# EAGLE design PhotonOnAStick-V3 (EAGLE 7.4.0)
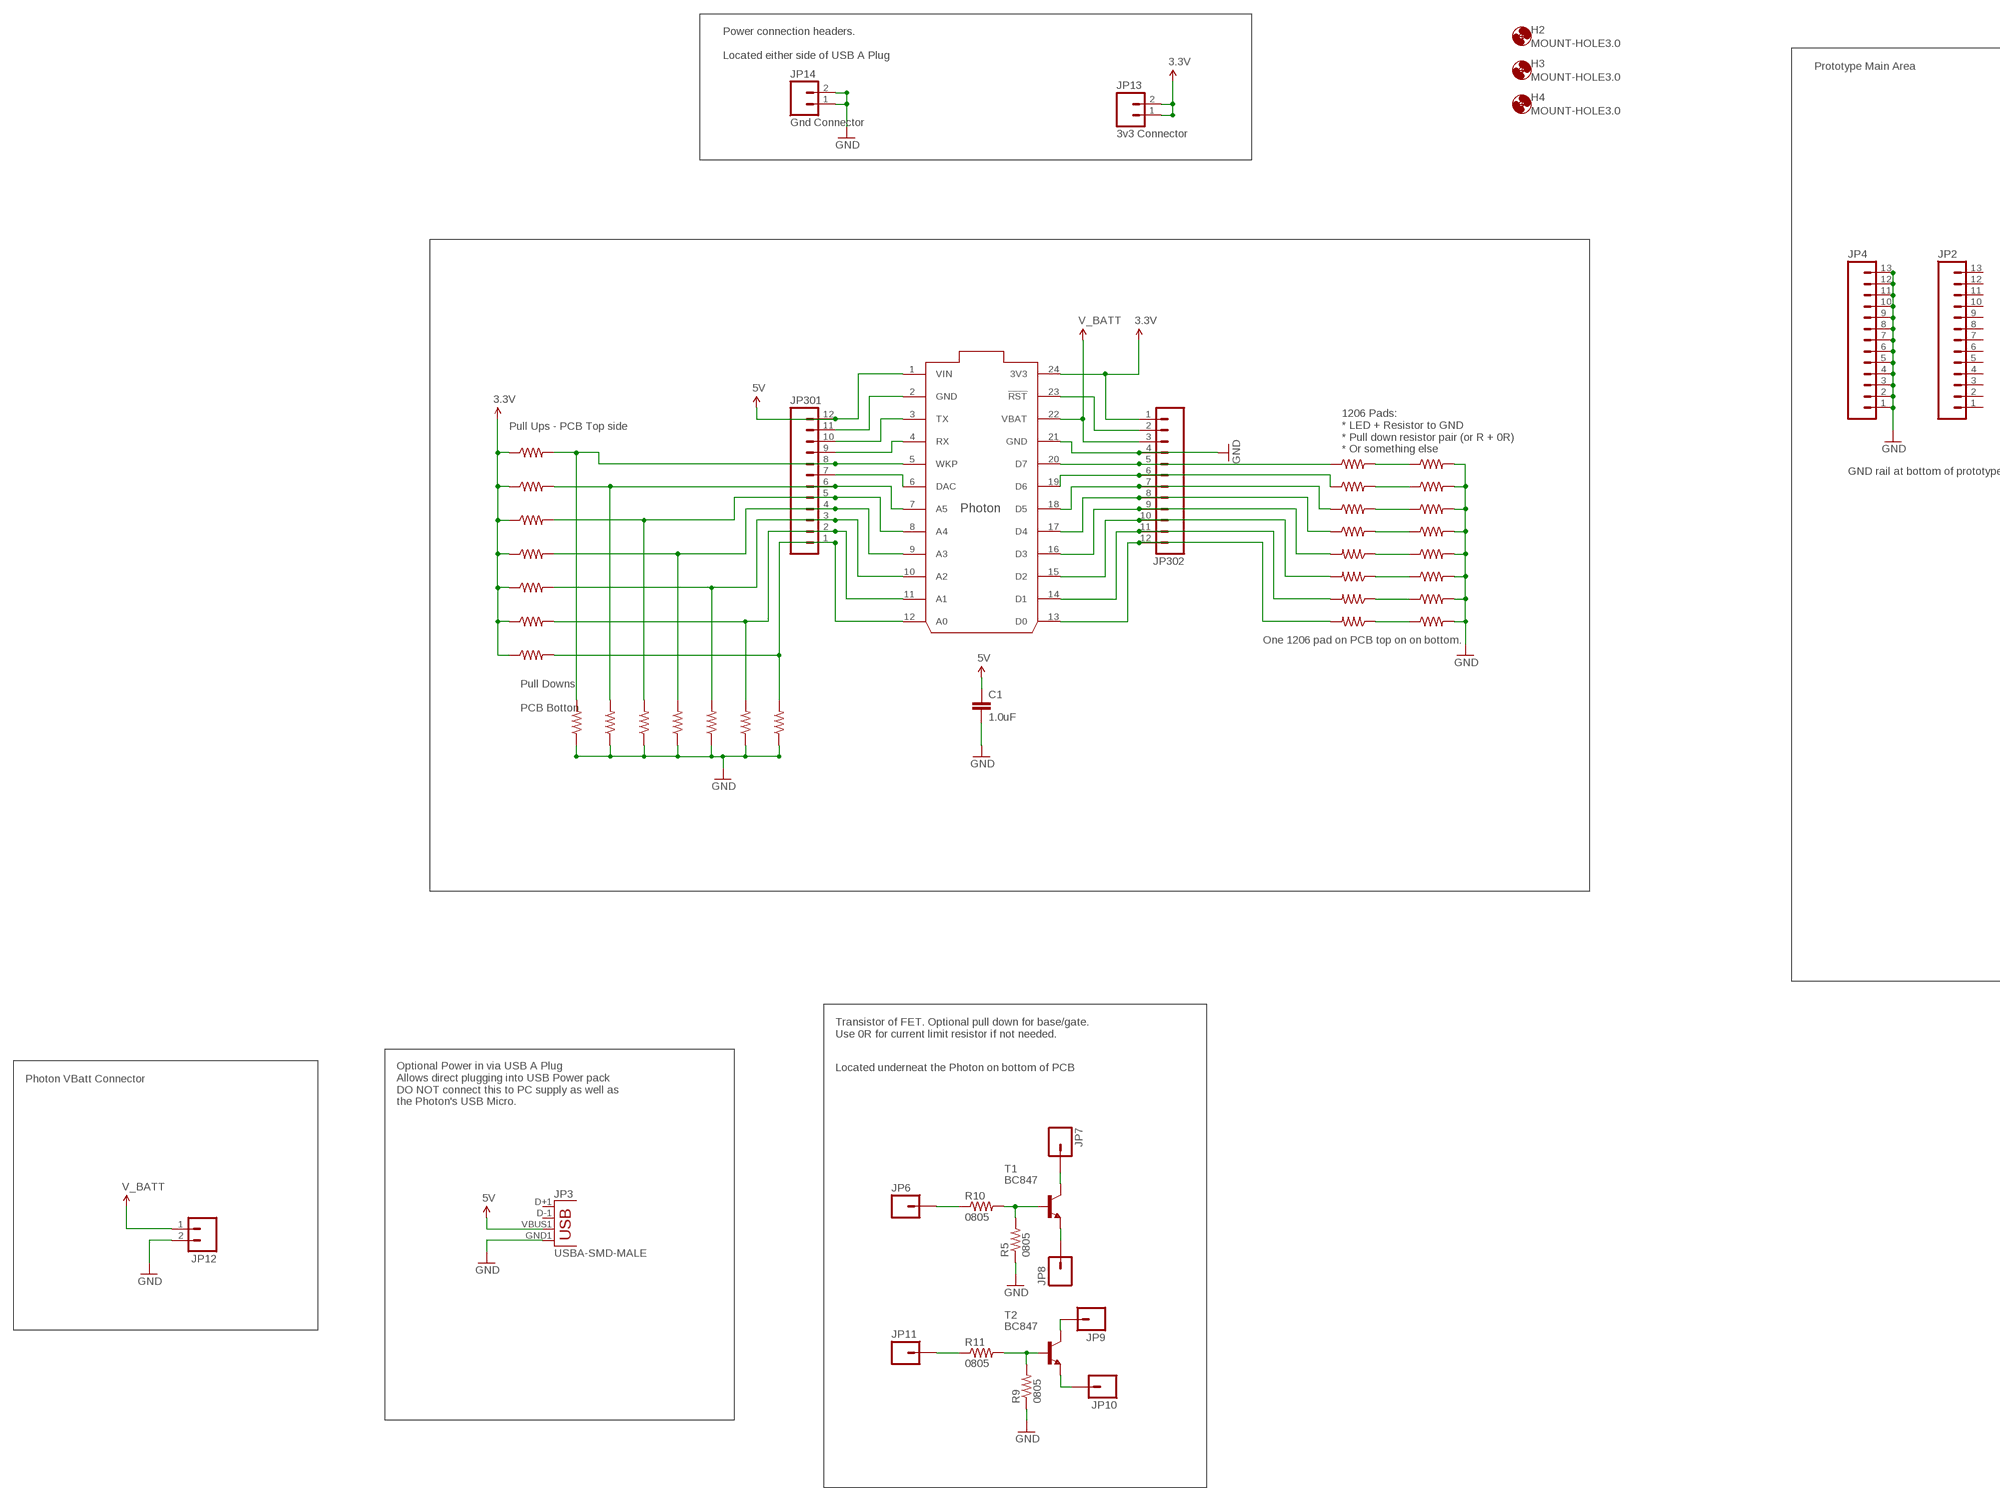
[diagram p0: schematic, sheet 1, part 1 of 2]
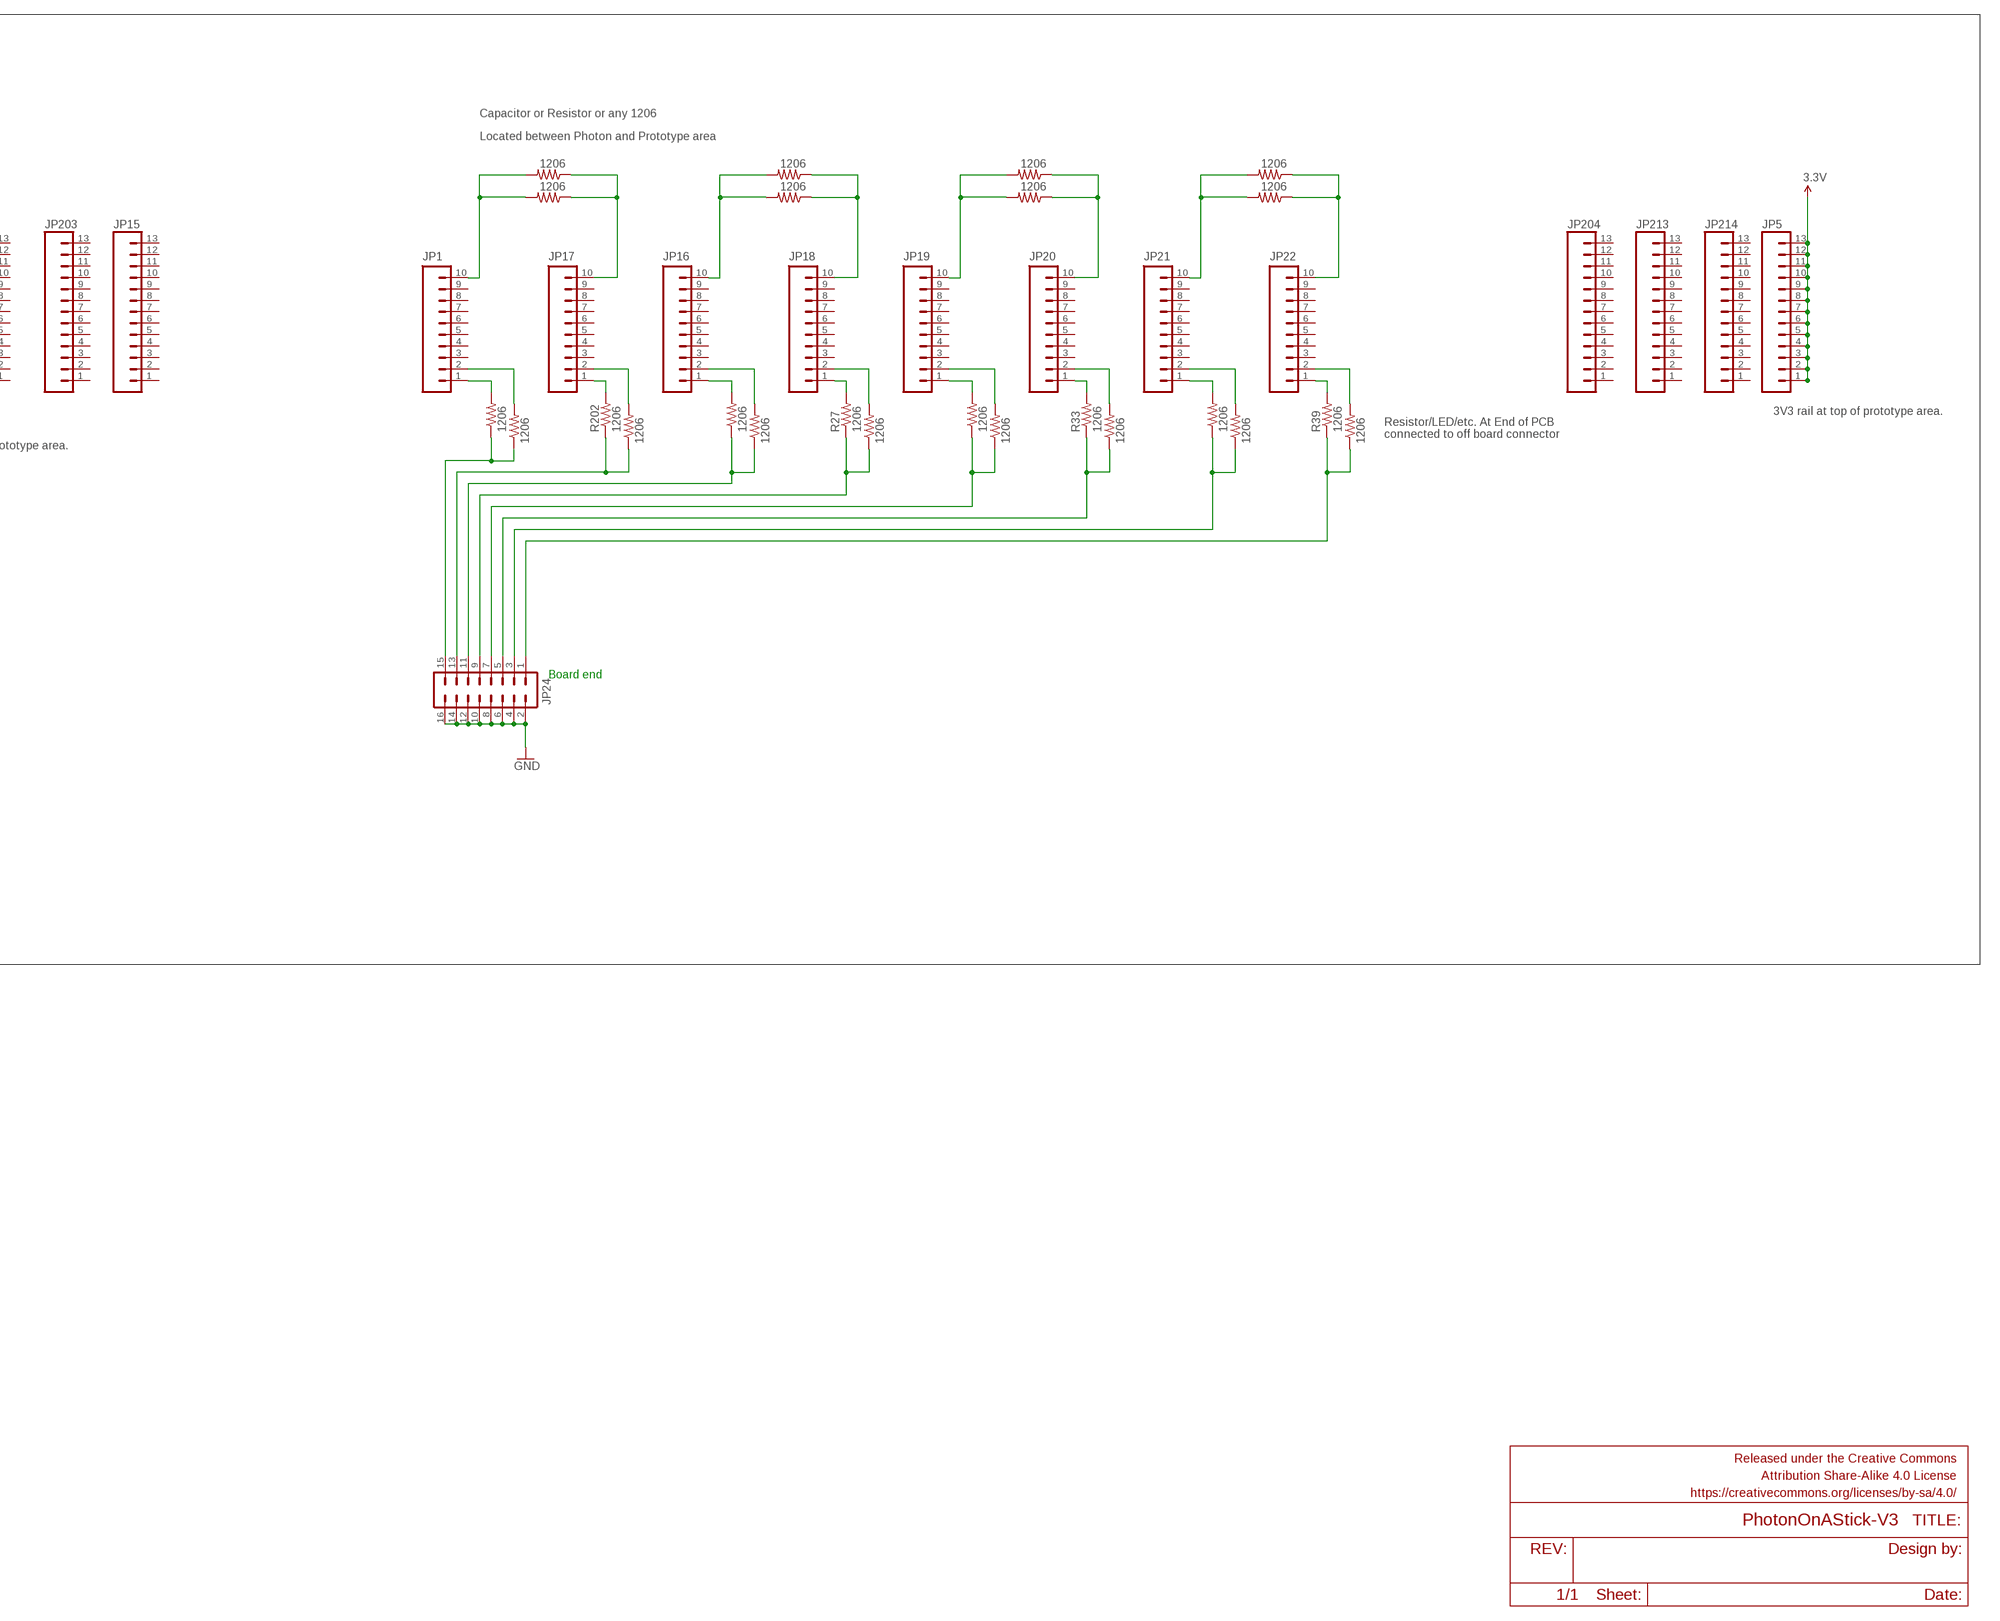
[diagram p1: schematic, sheet 1, part 2 of 2]

## Parts
C1  1.0uF  1.0UF-25V-+80/-20(0805)"  [0805-CAP]
FRAME1  FRAME-LEDGER  [CREATIVE_COMMONS]
H2  MOUNT-HOLE3.0  [3,0]
H3  MOUNT-HOLE3.0  [3,0]
H4  MOUNT-HOLE3.0  [3,0]
IC1  PHOTON_WITH_HEADERS  [PHOTON]
JP1  M10SILK_FEMALE_PTH  [1X10]
JP2  M13  [1X13]
JP3  USBA-SMD-MALE  [USB-A-SMT-MALE]
JP4  M13  [1X13]
JP5  M13  [1X13]
JP6  M01PTH  [1X01]
JP7  M01PTH  [1X01]
JP8  M01PTH  [1X01]
JP9  M01PTH  [1X01]
JP10  M01PTH  [1X01]
JP11  M01PTH  [1X01]
JP12  M02JST-PTH-2  [JST-2-PTH]
JP13  3v3 Connector  M02PTH  [1X02]
JP14  Gnd Connector  M02PTH  [1X02]
JP15  M13  [1X13]
JP16  M10SILK_FEMALE_PTH  [1X10]
JP17  M10SILK_FEMALE_PTH  [1X10]
JP18  M10SILK_FEMALE_PTH  [1X10]
JP19  M10SILK_FEMALE_PTH  [1X10]
JP20  M10SILK_FEMALE_PTH  [1X10]
JP21  M10SILK_FEMALE_PTH  [1X10]
JP22  M10SILK_FEMALE_PTH  [1X10]
JP24  M08X2  [2X8]
JP203  M13  [1X13]
JP204  M13  [1X13]
JP213  M13  [1X13]
JP214  M13  [1X13]
JP301  M12PTH  [1X12]
JP302  M12PTH  [1X12]
R1  1206  RESISTOR1206  [1206]
R2  1206  RESISTOR1206  [1206]
R3  1206  RESISTOR1206  [1206]
R4  1206  RESISTOR1206  [1206]
R5  0805  RESISTOR0805-RES  [0805]
R6  1206  RESISTOR1206  [1206]
R7  1206  RESISTOR1206  [1206]
R8  1206  RESISTOR1206  [1206]
R9  0805  RESISTOR0805-RES  [0805]
R10  0805  RESISTOR0805-RES  [0805]
R11  0805  RESISTOR0805-RES  [0805]
R12  1206  RESISTOR1206  [1206]
R13  1206  RESISTOR1206  [1206]
R14  1206  RESISTOR1206  [1206]
R15  1206  RESISTOR1206  [1206]
R16  1206  RESISTOR1206  [1206]
R17  1206  RESISTOR1206  [1206]
R18  1206  RESISTOR1206  [1206]
R19  1206  RESISTOR1206  [1206]
R20  1206  RESISTOR1206  [1206]
R21  1206  RESISTOR1206  [1206]
R22  1206  RESISTOR1206  [1206]
R23  1206  RESISTOR1206  [1206]
R24  1206  RESISTOR1206  [1206]
R25  1206  RESISTOR1206  [1206]
R26  1206  RESISTOR1206  [1206]
R27  1206  RESISTOR1206  [1206]
R28  1206  RESISTOR1206  [1206]
R29  1206  RESISTOR1206  [1206]
R30  1206  RESISTOR1206  [1206]
R31  1206  RESISTOR1206  [1206]
R32  1206  RESISTOR1206  [1206]
R33  1206  RESISTOR1206  [1206]
R34  1206  RESISTOR1206  [1206]
R35  1206  RESISTOR1206  [1206]
R36  1206  RESISTOR1206  [1206]
R37  1206  RESISTOR1206  [1206]
R38  1206  RESISTOR1206  [1206]
R39  1206  RESISTOR1206  [1206]
R40  1206  RESISTOR1206  [1206]
R41  1206  RESISTOR1206  [1206]
R42  1206  RESISTOR1206  [1206]
R43  1206  RESISTOR1206  [1206]
R44  1206  RESISTOR1206  [1206]
R201  1206  RESISTOR1206  [1206]
R202  1206  RESISTOR1206  [1206]
R313  1206  RESISTOR1206  [1206]
R314  1206  RESISTOR1206  [1206]
R315  1206  RESISTOR1206  [1206]
R316  1206  RESISTOR1206  [1206]
R317  1206  RESISTOR1206  [1206]
R318  1206  RESISTOR1206  [1206]
R319  1206  RESISTOR1206  [1206]
R320  1206  RESISTOR1206  [1206]
R410  1206  RESISTOR1206  [1206]
R411  1206  RESISTOR1206  [1206]
R412  1206  RESISTOR1206  [1206]
R413  1206  RESISTOR1206  [1206]
T1  BC847  [SOT23]
T2  BC847  [SOT23]

## Nets
3.3V: IC1.24(3V3) JP5.1 JP5.2 JP5.3 JP5.4 JP5.5 JP5.6 JP5.7 JP5.8 JP5.9 JP5.10 JP5.11 JP5.12 JP5.13 JP13.1 JP13.2 JP302.1 R1.1 R2.1 R3.1 R4.1 R6.1 R7.1 R12.1
5V: C1.1 IC1.1(VIN) JP3.VBUS1(VBUS) JP301.12
GND: C1.2 IC1.2(GND) IC1.21(GND) JP3.GND1(GND) JP4.1 JP4.2 JP4.3 JP4.4 JP4.5 JP4.6 JP4.7 JP4.8 JP4.9 JP4.10 JP4.11 JP4.12 JP4.13 JP12.2 JP14.1 JP14.2 JP24.2 JP24.4 JP24.6 JP24.8 JP24.10 JP24.12 JP24.14 JP24.16 JP301.11 JP302.4 R5.1 R8.1 R9.1 R13.1 R14.1 R15.2 R16.2 R17.2 R18.2 R19.1 R20.1 R21.1 R22.1 R410.2 R411.2 R412.2 R413.2
N$1: JP6.1 R10.1
N$2: JP17.1 R202.2
N$3: JP1.1 R201.2
N$4: IC1.3(TX) JP301.10
N$5: IC1.4(RX) JP301.9
N$6: IC1.5(WKP) JP301.8 R8.2 R12.2
N$7: IC1.6(DAC) JP301.7
N$8: IC1.7(A5) JP301.6 R1.2 R13.2
N$9: IC1.8(A4) JP301.5 R2.2 R14.2
N$10: IC1.9(A3) JP301.4 R3.2 R19.2
N$11: IC1.10(A2) JP301.3 R4.2 R20.2
N$12: IC1.11(A1) JP301.2 R6.2 R21.2
N$13: IC1.12(A0) JP301.1 R7.2 R22.2
N$14: JP24.15 R23.1 R201.1
N$15: R5.2 R10.2 T1.1(B)
N$16: IC1.18(D5) JP302.7 R318.1
N$17: IC1.17(D4) JP302.8 R317.1
N$18: IC1.16(D3) JP302.9 R316.2
N$19: IC1.15(D2) JP302.10 R315.2
N$20: IC1.14(D1) JP302.11 R314.2
N$21: IC1.13(D0) JP302.12 R313.2
N$22: JP1.2 R23.2
N$23: JP1.10 R24.2 R25.2
N$24: IC1.23(!RST) JP302.2
N$25: R320.2 R410.1
N$26: JP17.10 R24.1 R25.1
N$27: JP17.2 R26.2
N$28: JP24.13 R26.1 R202.1
N$29: JP18.1 R27.2
N$30: JP16.1 R28.2
N$31: JP24.11 R28.1 R29.1
N$32: JP16.2 R29.2
N$33: JP16.10 R30.2 R31.2
N$34: JP18.10 R30.1 R31.1
N$35: JP18.2 R32.2
N$36: JP24.9 R27.1 R32.1
N$37: JP20.1 R33.2
N$38: IC1.20(D7) JP302.5 R320.1
N$39: IC1.19(D6) JP302.6 R319.1
N$40: JP19.1 R34.2
N$41: JP7.1 T1.3(C)
N$43: JP24.7 R34.1 R35.1
N$44: R18.1 R313.1
N$45: R17.1 R314.1
N$46: R16.1 R315.1
N$47: R15.1 R316.1
N$48: R317.2 R413.1
N$49: R318.2 R412.1
N$50: R319.2 R411.1
N$52: JP19.2 R35.2
N$53: JP19.10 R36.2 R37.2
N$54: JP20.10 R36.1 R37.1
N$55: JP8.1 T1.2(E)
N$56: JP20.2 R38.2
N$57: JP24.5 R33.1 R38.1
N$58: JP22.1 R39.2
N$59: JP11.1 R11.1
N$60: R9.2 R11.2 T2.1(B)
N$61: JP9.1 T2.3(C)
N$62: JP10.1 T2.2(E)
N$63: JP21.1 R40.2
N$64: JP24.3 R40.1 R41.1
N$65: JP21.2 R41.2
N$68: JP21.10 R42.2 R43.2
N$69: JP22.10 R42.1 R43.1
N$70: JP22.2 R44.2
N$72: JP24.1 R39.1 R44.1
V_BATT: IC1.22(VBAT) JP12.1 JP302.3
Unconnected: JP1.3 JP1.4 JP1.5 JP1.6 JP1.7 JP1.8 JP1.9 JP2.1 JP2.2 JP2.3 JP2.4 JP2.5 JP2.6 JP2.7 JP2.8 JP2.9 JP2.10 JP2.11 JP2.12 JP2.13 JP3.D+1(D+) JP3.D-1(D-) JP15.1 JP15.2 JP15.3 JP15.4 JP15.5 JP15.6 JP15.7 JP15.8 JP15.9 JP15.10 JP15.11 JP15.12 JP15.13 JP16.3 JP16.4 JP16.5 JP16.6 JP16.7 JP16.8 JP16.9 JP17.3 JP17.4 JP17.5 JP17.6 JP17.7 JP17.8 JP17.9 JP18.3 JP18.4 JP18.5 JP18.6 JP18.7 JP18.8 JP18.9 JP19.3 JP19.4 JP19.5 JP19.6 JP19.7 JP19.8 JP19.9 JP20.3 JP20.4 JP20.5 JP20.6 JP20.7 JP20.8 JP20.9 JP21.3 JP21.4 JP21.5 JP21.6 JP21.7 JP21.8 JP21.9 JP22.3 JP22.4 JP22.5 JP22.6 JP22.7 JP22.8 JP22.9 JP203.1 JP203.2 JP203.3 JP203.4 JP203.5 JP203.6 JP203.7 JP203.8 JP203.9 JP203.10 JP203.11 JP203.12 JP203.13 JP204.1 JP204.2 JP204.3 JP204.4 JP204.5 JP204.6 JP204.7 JP204.8 JP204.9 JP204.10 JP204.11 JP204.12 JP204.13 JP213.1 JP213.2 JP213.3 JP213.4 JP213.5 JP213.6 JP213.7 JP213.8 JP213.9 JP213.10 JP213.11 JP213.12 JP213.13 JP214.1 JP214.2 JP214.3 JP214.4 JP214.5 JP214.6 JP214.7 JP214.8 JP214.9 JP214.10 JP214.11 JP214.12 JP214.13

## Notes on the sheet
- Power connection headers.
  
  Located either side of USB A Plug
- Prototype Main Area
- Capacitor or Resistor or any 1206
- Located between Photon and Prototype area
- Pull Ups - PCB Top side
- 3V3 rail at top of prototype area.
- 1206 Pads:
  * LED + Resistor to GND
  * Pull down resistor pair (or R + 0R)
  * Or something else
- Resistor/LED/etc. At End of PCB 
  connected to off board connector
- GND rail at bottom of prototype area.
- One 1206 pad on PCB top on on bottom.
- Board end
- Pull Downs
  
  PCB Botton
- Transistor of FET. Optional pull down for base/gate.
  Use 0R for current limit resistor if not needed.
- Located underneat the Photon on bottom of PCB
- Photon VBatt Connector
- Optional Power in via USB A Plug
  Allows direct plugging into USB Power pack
  DO NOT connect this to PC supply as well as
  the Photon's USB Micro.

## Library data of the parts
C1 = SparkFun-Capacitors:1.0UF-25V-+80/-20(0805): CAP-11625; PROD_ID: CAP-11625
FRAME1 = SparkFun-Aesthetics:FRAME-LEDGER: Schematic Frame Standard 11x14 US Ledger frame
H2-H4 = holes:MOUNT-HOLE: MOUNTING HOLE with drill center marker
IC1 = Spark:PHOTON
JP1 JP16-JP22 = SparkFun-Connectors:M10: Header 10 Standard 10-pin 0.1" header. Use with straight break away headers (SKU : PRT-00116), right angle break away headers (PRT-00553), swiss pins (PRT-00743), machine pins (PRT-00117), and female headers (PRT-00115).; PROD_ID: CONN-11563
JP2 JP4 JP5 JP15 JP203 JP204 JP213 JP214 = SparkFun-Connectors:M13: 13-pin single row .1" header
JP3 = SparkFun-Connectors:USB: USB Connectors USB-B-PTH is fully proven SKU : PRT-00139/CONN-08278 USB-miniB is fully proven SKU : PRT-00587 USB-A-PCB is untested. USB-A-H is throughly reviewed, but untested. Spark Fun Electronics SKU : PRT-00437 USB-B-SMT is throughly reviewed, but untested. Needs silkscreen touching up. USB-A-S has not been used/tested USB-MB-H has not been used/tested USB-MICROB has been used. CONN-09505
JP6-JP11 = SparkFun-Connectors:M01: Header 1 Standard 1-pin 0.1" header. Use with straight break away headers (SKU : PRT-00116), right angle break away headers (PRT-00553), swiss pins (PRT-00743), machine pins (PRT-00117), and female headers (PRT-00115).
JP12 = SparkFun-Connectors:M02: Standard 2-pin 0.1" header. Use with - straight break away headers ( PRT-00116) - right angle break away headers (PRT-00553) - swiss pins (PRT-00743) - machine pins (PRT-00117) - female headers (PRT-00115) Molex polarized connector foot print use with: PRT-08233 with associated crimp pins and housings. 2.54_SCREWTERM for use with PRT-10571. 3.5mm Screw Terminal footprints for PRT-08084 5mm Screw Terminal footprints for use with PRT-08432; PROD_ID: CONN-09863; SKU: PRT-09914
JP13 JP14 = SparkFun-Connectors:M02: Standard 2-pin 0.1" header. Use with - straight break away headers ( PRT-00116) - right angle break away headers (PRT-00553) - swiss pins (PRT-00743) - machine pins (PRT-00117) - female headers (PRT-00115) Molex polarized connector foot print use with: PRT-08233 with associated crimp pins and housings. 2.54_SCREWTERM for use with PRT-10571. 3.5mm Screw Terminal footprints for PRT-08084 5mm Screw Terminal footprints for use with PRT-08432
JP24 = SparkFun-Connectors:M08X2: .1" headers, two rows of 8 each
JP301 JP302 = SparkFun-Connectors:M12: Header 12 Standard 12-pin 0.1" header. Use with straight break away headers (SKU : PRT-00116), right angle break away headers (PRT-00553), swiss pins (PRT-00743), machine pins (PRT-00117), and female headers (PRT-00115).
R1-R44 R201 R202 R313-R320 R410-R413 = SparkFun-Resistors:RESISTOR: Resistor Basic schematic elements and footprints for 0603, 1206, and PTH resistors.
T1 T2 = transistor-neu-to92:BC847: NPN TRANSISTOR

## Board
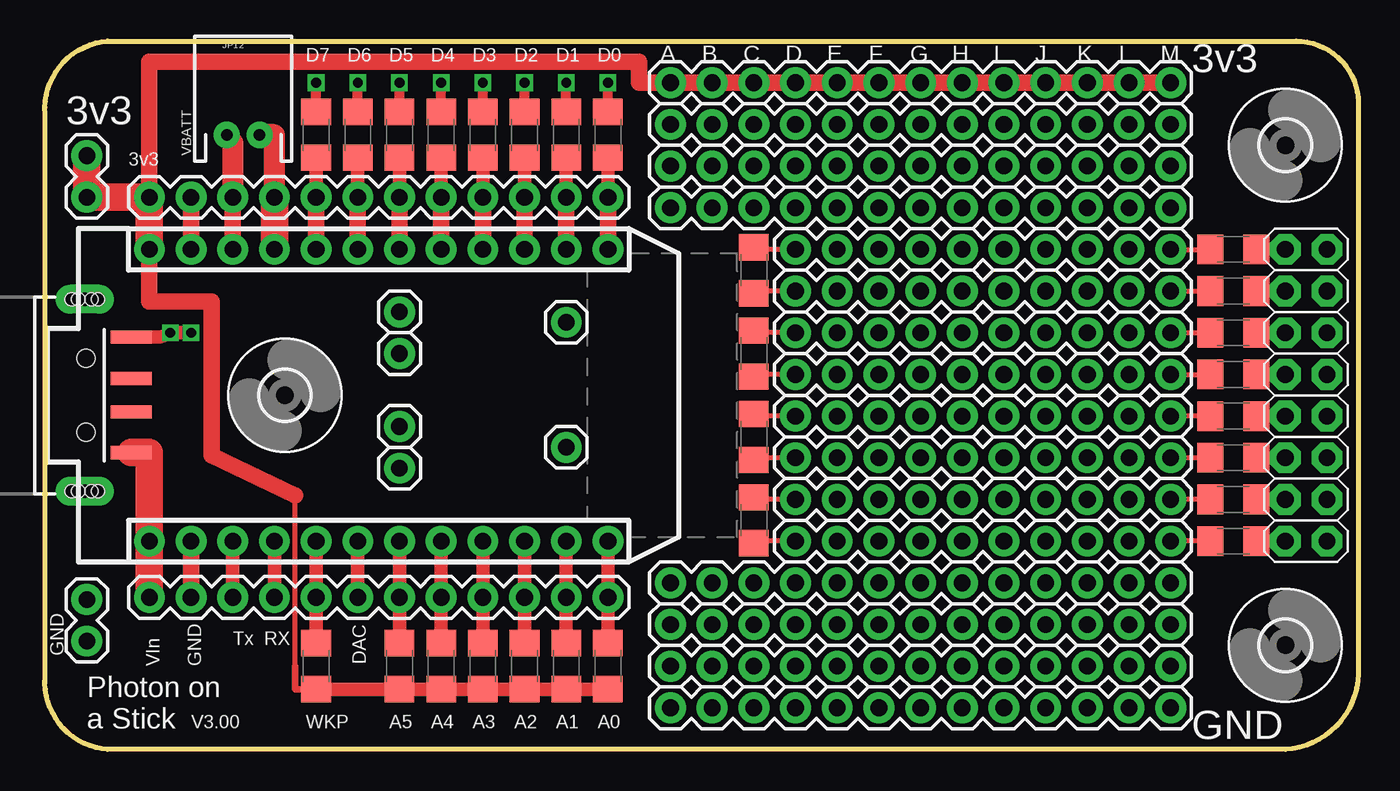
[diagram p2: board, top side]
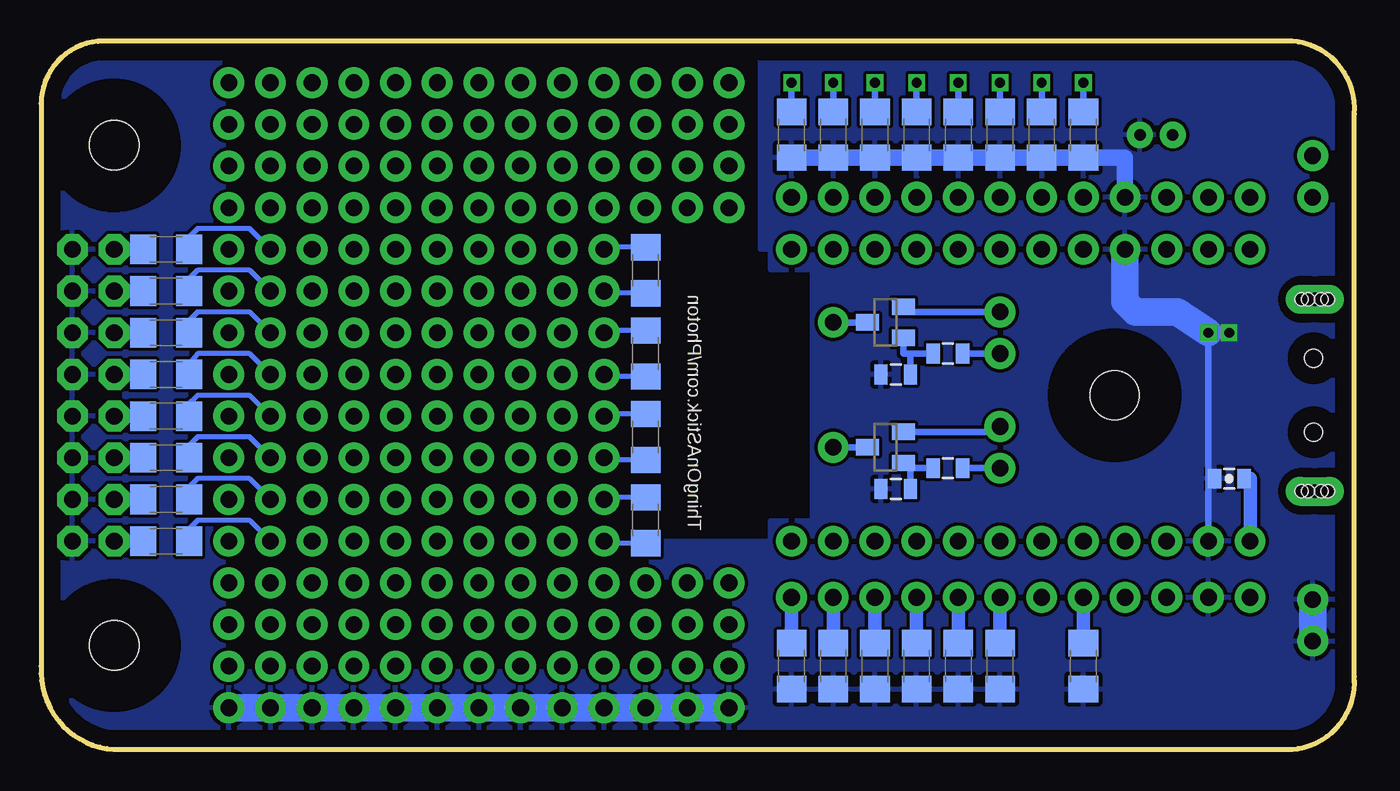
[diagram p3: board, bottom side, seen from below]

Size 80.03 x 43.18 mm. Coordinates in mm from the lower left corner, seen from the top.
Outline: 0.01,4.45 arc90 3.82,0 75.58,0 arc90 80.02,5.08 80.02,39.37 arc90 76.21,43.18 3.82,43.18 arc90 0.01,38.73 0.01,4.06
Copper layers (1*16): Top 0.035mm / dielectric 1.5mm / Bottom 0.035mm
Design rules "default": minimum track width 10mil, minimum drill 24mil, track to track 8mil, track to pad 8mil, pad to pad 8mil, via to via 8mil, smd to smd 8mil, copper to edge 40mil, drill to drill 8mil, minimum pad ring 10mil, minimum via ring 8mil, stop-mask expansion 4mil, vias tented up to drill 0mil, thermal gap 10mil

### Footprints (pad centres in the part's own frame; a part is rotated, then mirrored left to right if it is on the bottom)
0805-CAP = smd 0.8 x 1.2: 1 -0.9,0; 2 0.9,0
3,0 = hole 3: 0,0
PHOTON = drill 1.016 pad 1.88: 1 1.27,32.258; 2 1.27,29.718; 3 1.27,27.178; 4 1.27,24.638; 5 1.27,22.098; 6 1.27,19.558; 7 1.27,17.018; 8 1.27,14.478; 9 1.27,11.938; 10 1.27,9.398; 11 1.27,6.858; 12 1.27,4.318; 13 19.05,4.318; 14 19.05,6.858; 15 19.05,9.398; 16 19.05,11.938; 17 19.05,14.478; 18 19.05,17.018; 19 19.05,19.558; 20 19.05,22.098; 21 19.05,24.638; 22 19.05,27.178; 23 19.05,29.718; 24 19.05,32.258
1X10 = drill 1.016 pad 1.88: 1 0,0; 2 2.54,0; 3 5.08,0; 4 7.62,0; 5 10.16,0; 6 12.7,0; 7 15.24,0; 8 17.78,0; 9 20.32,0; 10 22.86,0
1X13 = drill 1.016 pad 1.88: 1 0,0; 2 2.54,0; 3 5.08,0; 4 7.62,0; 5 10.16,0; 6 12.7,0; 7 15.24,0; 8 17.78,0; 9 20.32,0; 10 22.86,0; 11 25.4,0; 12 27.94,0; 13 30.48,0
USB-A-SMT-MALE = smd 0.8 x 2.5: D+1 1.027,-5.87; D-1 -1.027,-5.87; GND1 3.551,-5.87; VBUS1 -3.5,-5.87 | drill 0.8 pad 1.778 long: P$1 5.85,-3.05; P$3 -5.85,-3.05 | hole 1.1: 2.25,-3.12; -2.25,-3.12 | hole 0.8: -5.85,-3.45; -5.85,-3.85; -5.85,-2.65; -5.85,-2.25; 5.85,-3.45; 5.85,-3.85; 5.85,-2.65; 5.85,-2.25
1X01 = drill 1.016 pad 1.88: 1 0,0
JST-2-PTH = drill 0.7 pad 1.6: 1 -1,0; 2 1,0
1X02 = drill 1.016 pad 1.88: 1 0,0; 2 2.54,0
2X8 = drill 1.016 pad 1.88 octagon: 1 0,0; 2 0,2.54; 3 2.54,0; 4 2.54,2.54; 5 5.08,0; 6 5.08,2.54; 7 7.62,0; 8 7.62,2.54; 9 10.16,0; 10 10.16,2.54; 11 12.7,0; 12 12.7,2.54; 13 15.24,0; 14 15.24,2.54; 15 17.78,0; 16 17.78,2.54
1X12 = drill 1.016 pad 1.88: 1 0,0; 2 2.54,0; 3 5.08,0; 4 7.62,0; 5 10.16,0; 6 12.7,0; 7 15.24,0; 8 17.78,0; 9 20.32,0; 10 22.86,0; 11 25.4,0; 12 27.94,0
1206 = smd 1.6 x 1.8: 1 -1.4,0; 2 1.4,0
0805 = smd 0.8 x 1.2: 1 -0.9,0; 2 0.9,0
SOT23 = smd 1 x 1.4: 1 -0.95,-1.1; 2 0.95,-1.1; 3 0,1.1

### Placement (x,y rotation side)
C1  7.63,16.51 180 bottom
FRAME1  -5.07,-8.25 0 top  (outside the outline)
H2  14.62,21.59 0 top
H3  75.58,36.83 0 top
H4  75.58,6.35 0 top
IC1  38.62,11.43 90 top
JP1  68.59,12.7 180 top
JP2  68.59,38.1 180 top
JP3  -0.62,21.59 90 top
JP4  68.59,2.54 180 top
JP5  68.59,40.64 180 top
JP6  21.6,24.13 0 top
JP7  31.76,26.04 0 top
JP8  21.6,26.67 0 top
JP9  31.76,18.41 0 top
JP10  21.6,19.68 0 top
JP11  21.6,17.14 0 top
JP12  12.08,37.46 0 top
JP13  2.55,33.66 90 top
JP14  2.55,9.14 270 top
JP15  68.59,5.08 180 top
JP16  68.59,17.78 180 top
JP17  68.59,15.24 180 top
JP18  68.59,20.32 180 top
JP19  68.59,22.86 180 top
JP20  68.59,25.4 180 top
JP21  68.59,27.94 180 top
JP22  68.59,30.48 180 top
JP24  75.58,30.48 270 top
JP203  68.59,35.56 180 top
JP204  68.59,33.02 180 top
JP213  68.59,10.16 180 top
JP214  68.59,7.62 180 top
JP301  34.3,9.27 180 top
JP302  6.36,33.66 0 top
R1  21.6,5.08 90 top
R2  24.14,5.08 90 top
R3  26.68,5.08 90 top
R4  29.22,5.08 90 top
R5  27.95,22.86 0 bottom
R6  31.76,5.08 90 top
R7  34.3,5.08 90 top
R8  16.52,5.08 90 bottom
R9  27.95,15.88 0 bottom
R10  24.78,24.13 180 bottom
R11  24.78,17.14 180 bottom
R12  16.52,5.08 90 top
R13  21.6,5.08 90 bottom
R14  24.14,5.08 90 bottom
R15  26.68,37.46 270 bottom
R16  29.22,37.46 270 bottom
R17  31.76,37.46 270 bottom
R18  34.3,37.46 270 bottom
R19  26.68,5.08 90 bottom
R20  29.22,5.08 90 bottom
R21  31.76,5.08 90 bottom
R22  34.3,5.08 90 bottom
R23  72.4,12.7 0 bottom
R24  43.19,13.97 270 top
R25  43.19,13.97 270 bottom
R26  72.4,15.24 0 bottom
R27  72.4,20.32 180 top
R28  72.4,17.78 180 top
R29  72.4,17.78 0 bottom
R30  43.19,19.05 270 top
R31  43.19,19.05 270 bottom
R32  72.4,20.32 0 bottom
R33  72.4,25.4 180 top
R34  72.4,22.86 180 top
R35  72.4,22.86 0 bottom
R36  43.19,24.13 270 top
R37  43.19,24.13 270 bottom
R38  72.4,25.4 0 bottom
R39  72.4,30.48 180 top
R40  72.4,27.94 180 top
R41  72.4,27.94 0 bottom
R42  43.19,29.21 270 top
R43  43.19,29.21 270 bottom
R44  72.4,30.48 0 bottom
R201  72.4,12.7 180 top
R202  72.4,15.24 180 top
R313  34.3,37.46 270 top
R314  31.76,37.46 270 top
R315  29.22,37.46 270 top
R316  26.68,37.46 270 top
R317  24.14,37.46 90 top
R318  21.6,37.46 90 top
R319  19.06,37.46 90 top
R320  16.52,37.46 90 top
R410  16.52,37.46 270 bottom
R411  19.06,37.46 270 bottom
R412  21.6,37.46 270 bottom
R413  24.14,37.46 270 bottom
T1  28.59,26.04 90 bottom
T2  28.59,18.41 90 bottom

### Tracks (layer width: path | path; a pad name or v marks a point on that pad's centre or on a via)
3.3V
  Top 0.305: 15.25,4.18 15.25,5.08 15.25,15.49
  Top 0.406: R12.1 15.25,3.68 15.25,5.08
  Top 0.813: R7.1 R6.1 R4.1 R3.1 R2.1 R1.1 R12.1
  Top 1.016: JP302.1 6.36,41.91 36.21,41.91 36.21,40.64 JP5.13 JP5.12 JP5.11 JP5.10 JP5.9 JP5.8 JP5.7 JP5.6 JP5.5 JP5.4 JP5.3 JP5.2 JP5.1 | 15.25,15.49 10.17,17.91 10.17,27.3 6.36,27.3 IC1.24
  Top 1.676: IC1.24 JP302.1 JP13.1 JP13.2
5V
  Top 1.016: IC1.1 6.36,15.24
  Top 1.676: JP3.VBUS1 6.36,18.09 IC1.1 JP301.12
  Bottom 0.813: C1.1 6.36,16.51 IC1.1
GND  (via drill 0.6)
  Top 0.813: JP3.GND1 7,25.14 7,25.15 7.89,25.4 v8.9,25.4
  Top 1.016: 13.98,30.35 arc-90 IC1.21 | IC1.2 JP301.11
  Top 1.27: JP302.4 13.98,37.46 JP12.2
  Top 1.676: IC1.21 JP302.4
  Bottom 0.406: IC1.2 v8.9,25.4 | C1.2 8.9,16.51
  Bottom 0.813: 13.98,30.35 IC1.21
  Bottom 1.016: R18.2 R17.2 R16.2 R15.2 R413.2 R412.2 R411.2 R410.2 13.98,36.06 JP302.4
  Bottom 1.676: JP4.1 JP4.2 JP4.3 JP4.4 JP4.5 JP4.6 JP4.7 JP4.8 JP4.9 JP4.10 JP4.11 JP4.12 JP4.13 | 13.98,30.35 13.98,27.3 13.35,26.67 10.81,26.67 v8.9,25.4 | JP14.1 JP14.2
  other vias: 7.63,25.4
  pour Bottom: -2.53,-0.63 81.29,-0.63 81.29,44.45 36.84,44.45 36.84,30.48 42.56,30.48 42.56,12.7 35.57,12.7 35.57,13.97 33.03,13.97 33.03,29.21 35.57,29.21 35.57,30.48 36.21,30.48 36.21,44.45 -2.53,44.45
N$1
  Bottom 0.406: R10.1 JP6.1
N$2
  Top 0.305: R202.2 JP17.1
N$3
  Top 0.305: R201.2 JP1.1
N$4
  Top 0.813: JP301.10 IC1.3
N$5
  Top 0.813: JP301.9 IC1.4
N$6
  Top 0.813: R8.2 JP301.8 IC1.5
  Bottom 0.813: R8.2 JP301.8
N$7
  Top 0.813: JP301.7 IC1.6
N$8
  Top 0.813: R13.2 JP301.6 IC1.7
  Bottom 0.813: R13.2 JP301.6
N$9
  Top 0.813: R14.2 JP301.5 IC1.8
  Bottom 0.813: 24.27,9.53 JP301.5 R14.2
N$10
  Top 0.813: R19.2 JP301.4 IC1.9
  Bottom 0.813: R19.2 JP301.4
N$11
  Top 0.813: R20.2 JP301.3 IC1.10
  Bottom 0.813: 29.35,9.53 JP301.3 R20.2
N$12
  Top 0.813: R21.2 JP301.2 IC1.11
  Bottom 0.813: R21.2 JP301.2
N$13
  Top 0.813: R22.2 JP301.1 IC1.12
  Bottom 0.813: 34.43,9.53 JP301.1 R22.2
N$14
  Top 0.305: R23.1 JP24.15
  Bottom 0.305: R23.1 JP24.15
N$15
  Bottom 0.406: R10.2 27.05,24.13 | T1.1 27.49,24.13 27.05,24.13 | 27.05,24.13 R5.2
N$16
  Top 0.813: R318.1 JP302.7
  Top 1.016: IC1.18 JP302.7
N$17
  Top 0.813: R317.1 JP302.8
  Top 1.016: IC1.17 JP302.8
N$18
  Top 0.813: R316.2 JP302.9
  Top 1.016: IC1.16 JP302.9
N$19
  Top 0.813: R315.2 JP302.10
  Top 1.016: IC1.15 JP302.10
N$20
  Top 0.813: R314.2 JP302.11
  Top 1.016: IC1.14 JP302.11
N$21
  Top 0.813: R313.2 JP302.12
  Top 1.016: IC1.13 JP302.12
N$22
  Bottom 0.305: JP1.2 67.32,13.97 70.5,13.97 71.13,13.34 71.13,12.83 R23.2
N$23
  Top 0.305: JP1.10 43.32,12.7 R25.2
  Bottom 0.305: R25.2 45.73,12.57 JP1.10
N$24
  Top 1.016: IC1.23 JP302.2
N$25  (via drill 0.6)
  Top 0.61: R410.1 v16.52,40.64
  Bottom 0.406: R410.1 v16.52,40.64
N$26
  Top 0.305: JP17.10 43.32,15.24 R25.1
  Bottom 0.305: R25.1 45.73,15.37 JP17.10
N$27
  Bottom 0.305: JP17.2 67.32,16.51 70.5,16.51 71.13,15.88 71.13,15.37 R26.2
N$28
  Top 0.305: R26.1 JP24.13
  Bottom 0.305: R26.1 JP24.13
N$29
  Top 0.305: R27.2 JP18.1
N$30
  Top 0.305: R28.2 JP16.1
N$31
  Top 0.305: R29.1 JP24.11
  Bottom 0.305: JP24.11 R29.1
N$32
  Bottom 0.305: JP16.2 67.32,19.05 70.5,19.05 71.13,18.41 71.13,17.91 R29.2
N$33
  Top 0.305: JP16.10 43.32,17.78 R31.2
  Bottom 0.305: R31.2 45.73,17.65 JP16.10
N$34
  Top 0.305: JP18.10 43.32,20.32 R31.1
  Bottom 0.305: R31.1 45.73,20.45 JP18.10
N$35
  Bottom 0.305: JP18.2 67.32,21.59 70.5,21.59 71.13,20.95 71.13,20.45 R32.2
N$36
  Top 0.305: R32.1 JP24.9
  Bottom 0.305: R32.1 JP24.9
N$37
  Top 0.305: JP20.1 R33.2
N$38
  Top 0.813: R320.1 JP302.5
  Top 1.016: IC1.20 JP302.5
N$39
  Top 0.813: R319.1 JP302.6
  Top 1.016: IC1.19 JP302.6
N$40
  Top 0.305: JP19.1 R34.2
N$41
  Bottom 0.406: T1.3 JP7.1
N$43
  Top 0.305: R35.1 JP24.7
  Bottom 0.305: R35.1 JP24.7
N$44  (via drill 0.6)
  Top 0.61: R18.1 v34.3,40.64
  Bottom 0.406: R18.1 v34.3,40.64
N$45  (via drill 0.6)
  Top 0.61: R17.1 v31.76,40.64
  Bottom 0.406: R17.1 v31.76,40.64
N$46  (via drill 0.6)
  Top 0.61: R16.1 v29.22,40.64
  Bottom 0.406: R16.1 v29.22,40.64
N$47  (via drill 0.6)
  Top 0.61: R15.1 v26.68,40.64
  Bottom 0.406: R15.1 v26.68,40.64
N$48  (via drill 0.6)
  Top 0.61: R413.1 v24.14,40.64
  Bottom 0.406: R413.1 v24.14,40.64
N$49  (via drill 0.6)
  Top 0.61: R412.1 v21.6,40.64
  Bottom 0.406: R412.1 v21.6,40.64
N$50  (via drill 0.6)
  Top 0.61: R411.1 v19.06,40.64
  Bottom 0.406: R411.1 v19.06,40.64
N$52
  Bottom 0.305: JP19.2 67.32,24.13 70.5,24.13 71.13,23.36 R35.2
N$53
  Top 0.305: JP19.10 43.32,22.86 R37.2
  Bottom 0.305: R37.2 45.73,22.73 JP19.10
N$54
  Top 0.305: JP20.10 43.32,25.4 R37.1
  Bottom 0.305: R37.1 45.73,25.53 JP20.10
N$55
  Bottom 0.406: JP8.1 26.85,26.67 T1.2
N$56
  Bottom 0.305: JP20.2 67.32,26.67 70.5,26.67 71.13,26.04 71.13,25.53 R38.2
N$57
  Top 0.305: R38.1 JP24.5
  Bottom 0.305: R38.1 JP24.5
N$58
  Top 0.305: JP22.1 R39.2
N$59
  Bottom 0.406: R11.1 JP11.1
N$60
  Bottom 0.406: R11.2 27.05,17.14 | T2.1 27.49,17.14 27.05,17.14 | 27.05,17.14 R9.2
N$61
  Bottom 0.406: T2.3 JP9.1
N$62
  Bottom 0.406: T2.2 21.6,19.36 JP10.1
N$63
  Top 0.305: JP21.1 R40.2
N$64
  Top 0.305: R41.1 JP24.3
  Bottom 0.305: 73.67,27.94 R41.1 JP24.3
N$65
  Bottom 0.305: JP21.2 67.32,29.21 70.5,29.21 71.13,28.57 71.13,28.07 R41.2
N$68
  Top 0.305: JP21.10 43.32,27.94 R43.2
  Bottom 0.305: R43.2 45.73,27.81 JP21.10
N$69
  Top 0.305: JP22.10 43.32,30.48 R43.1
  Bottom 0.305: R43.1 45.73,30.61 JP22.10
N$70
  Bottom 0.305: JP22.2 67.32,31.75 70.5,31.75 71.13,31.11 71.13,30.61 R44.2
N$72
  Top 0.305: R44.1 JP24.1
  Bottom 0.305: R44.1 JP24.1
V_BATT
  Top 1.016: IC1.22 JP302.3
  Top 1.27: JP12.1 11.06,37.45 11.06,37.34 11.44,36.96 JP302.3

### Text on the board
tNames: D7 | D6 | D5 | D4 | D3 | D2 | D1 | D0 | A | B | C | D | E | F | G | H | I | J | K | L | M | 3v3 | 3v3 | VBATT | 3v3 | Tx | RX | GND | VIn | GND | DAC | Photon on / a Stick | V3.00 | WKP | A5 | A4 | A3 | A2 | A1 | A0 | GND
bNames: ThingOnAStick.com/Photon